# EAGLE schematic misko (EAGLE 8.1.0)
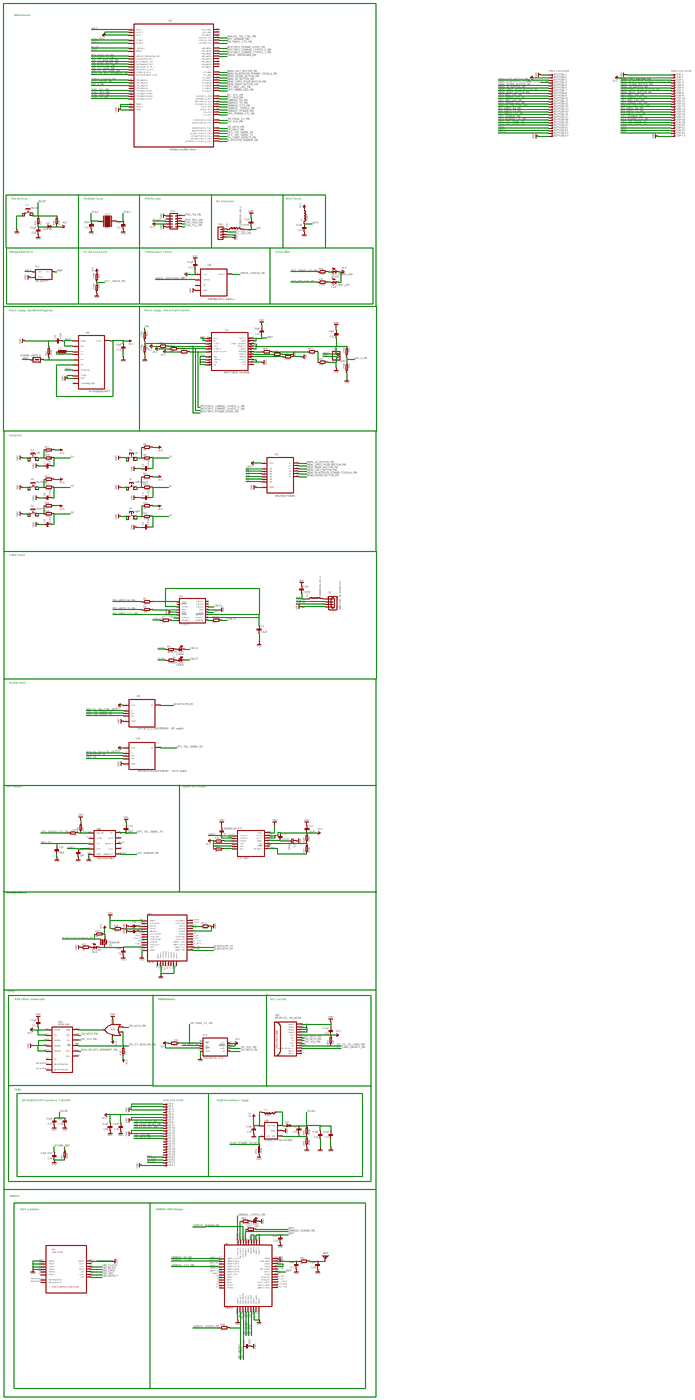
[diagram p0: schematic, sheet 1, overview]
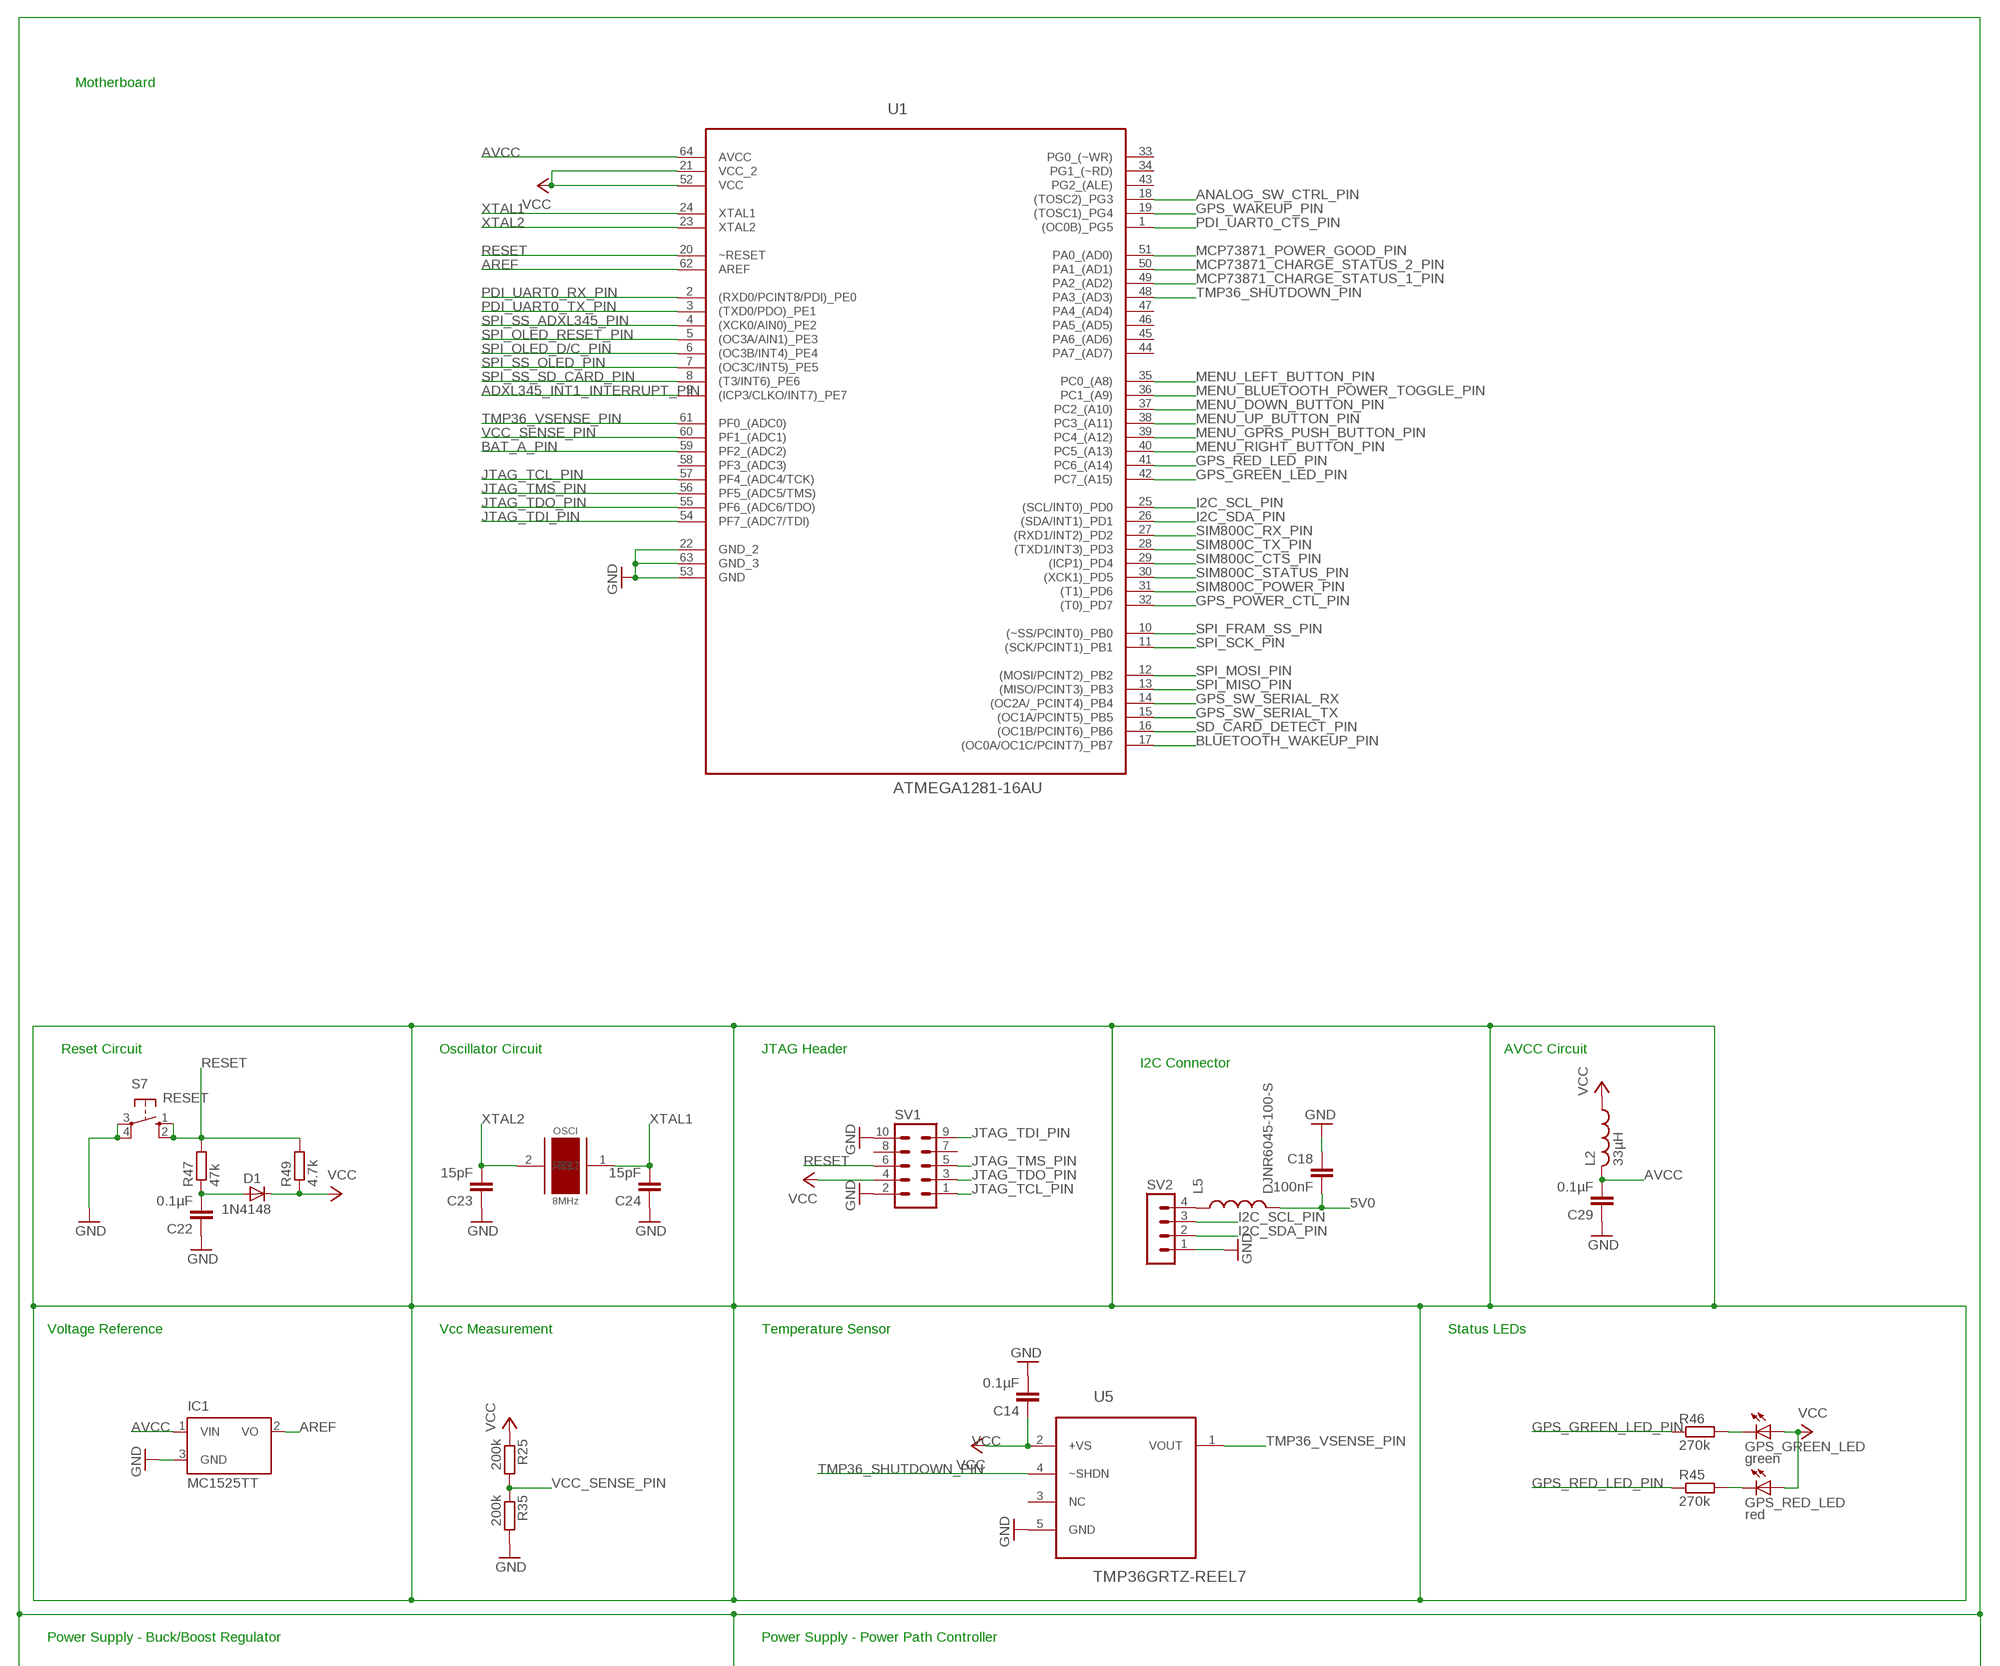
[diagram p1: schematic, sheet 1, part 1 of 5]
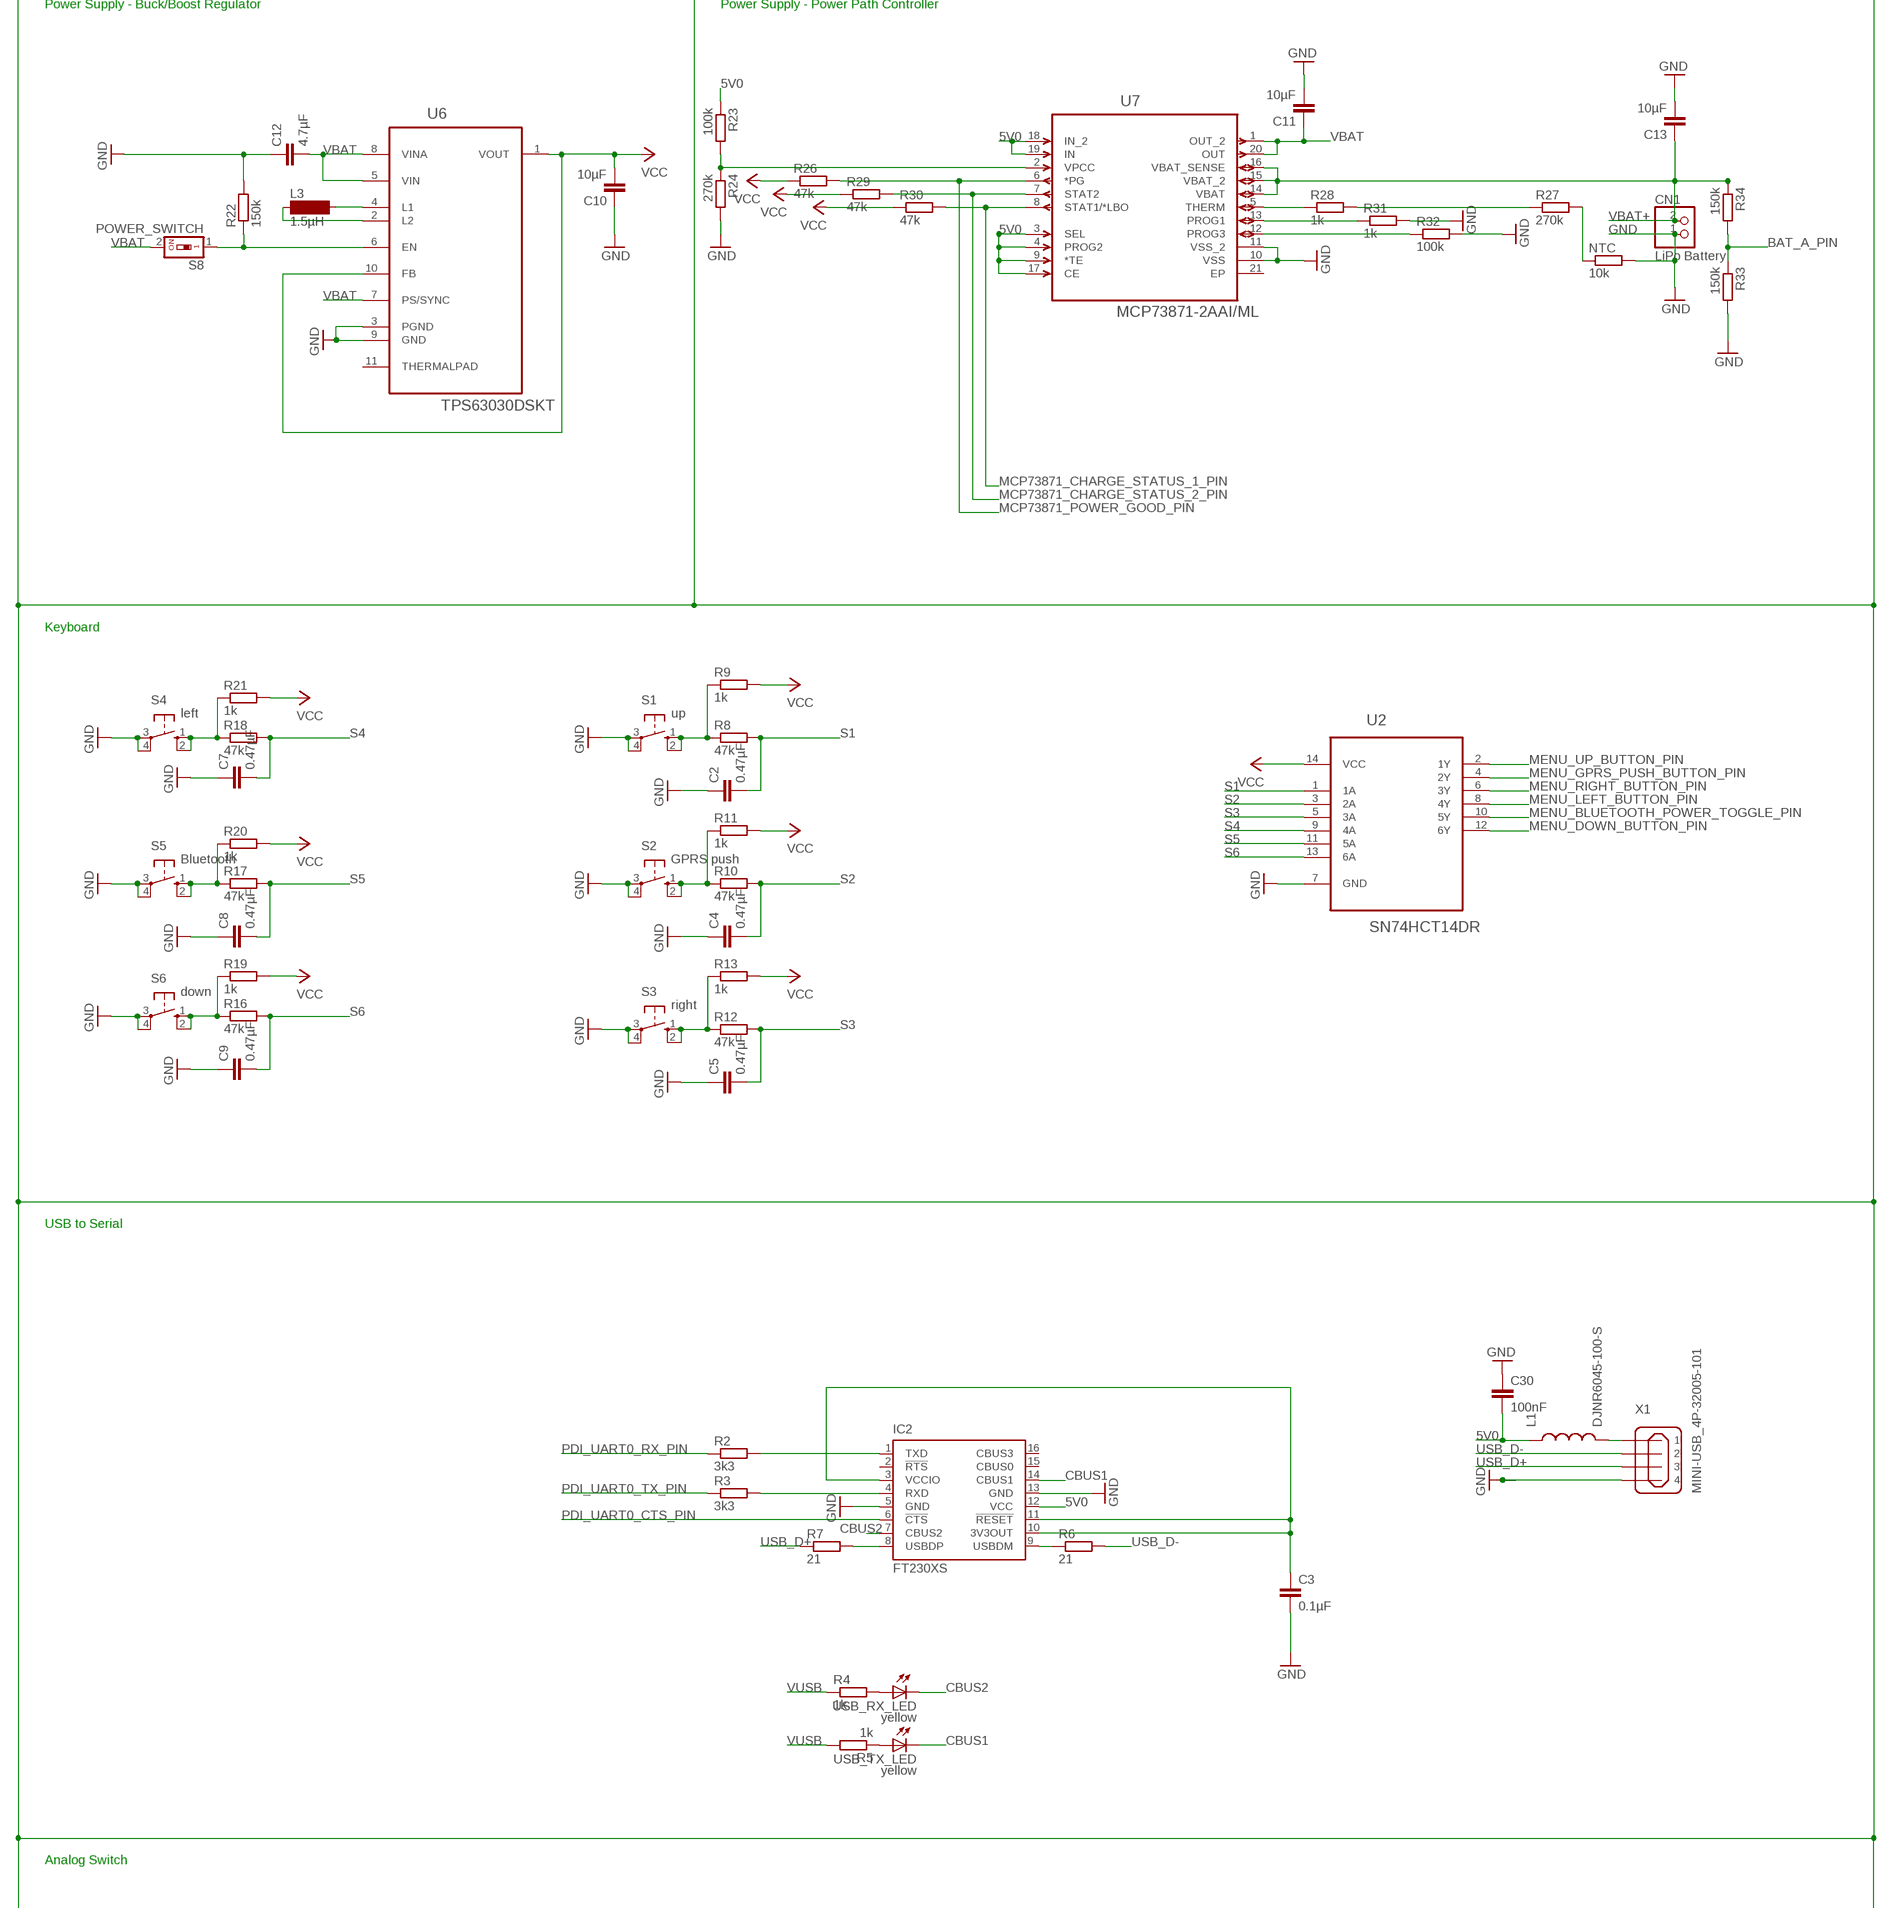
[diagram p2: schematic, sheet 1, part 2 of 5]
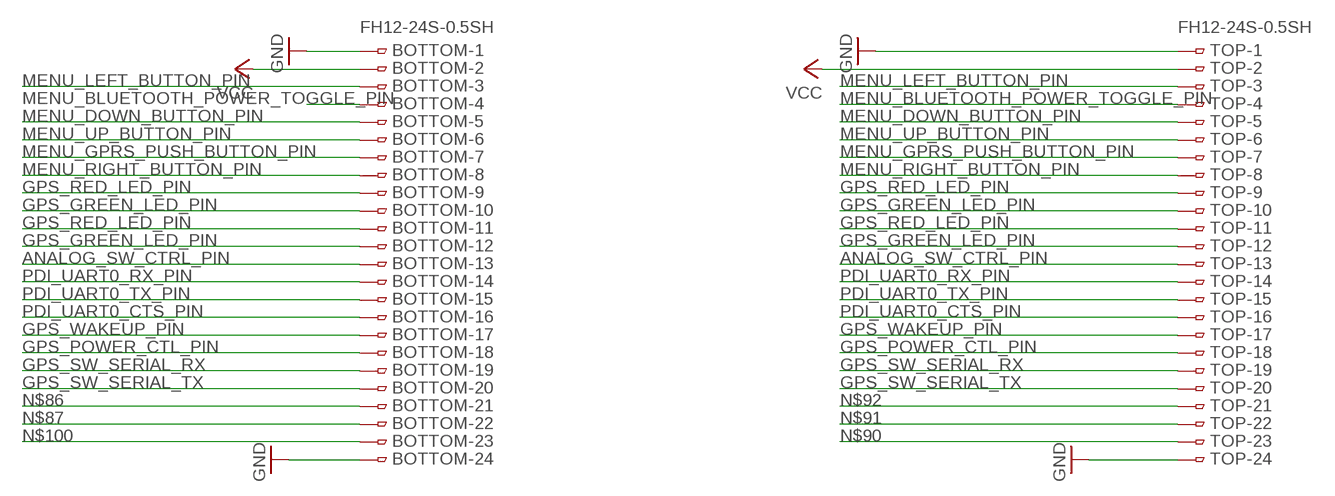
[diagram p3: schematic, sheet 1, part 3 of 5]
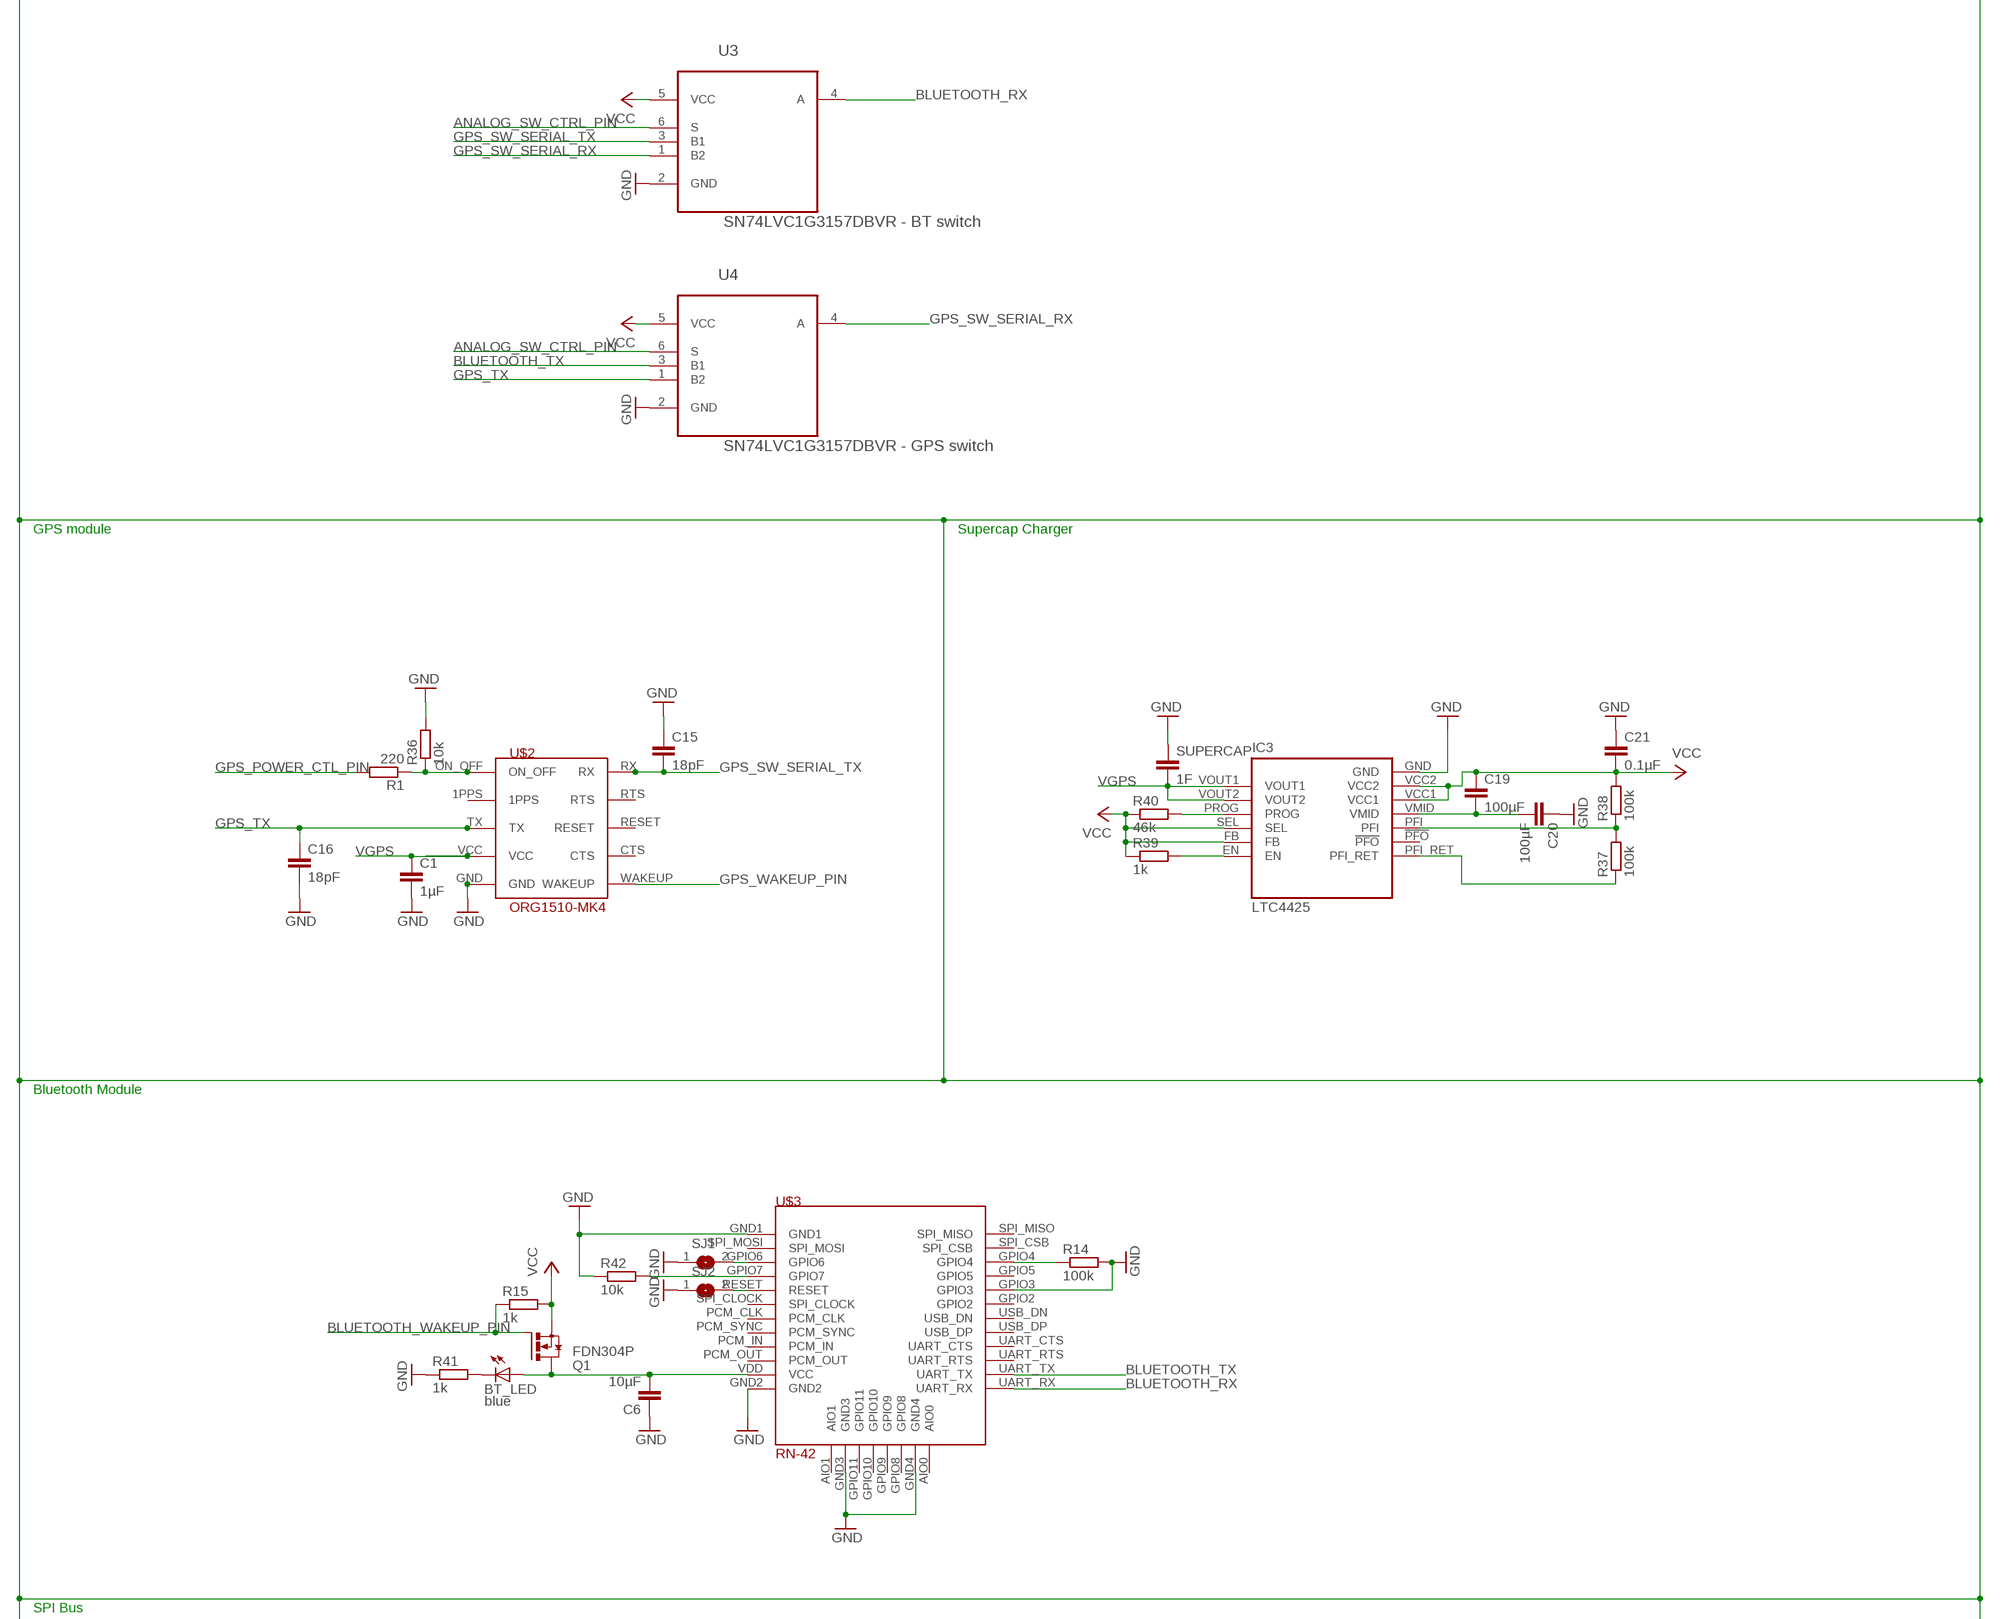
[diagram p4: schematic, sheet 1, part 4 of 5]
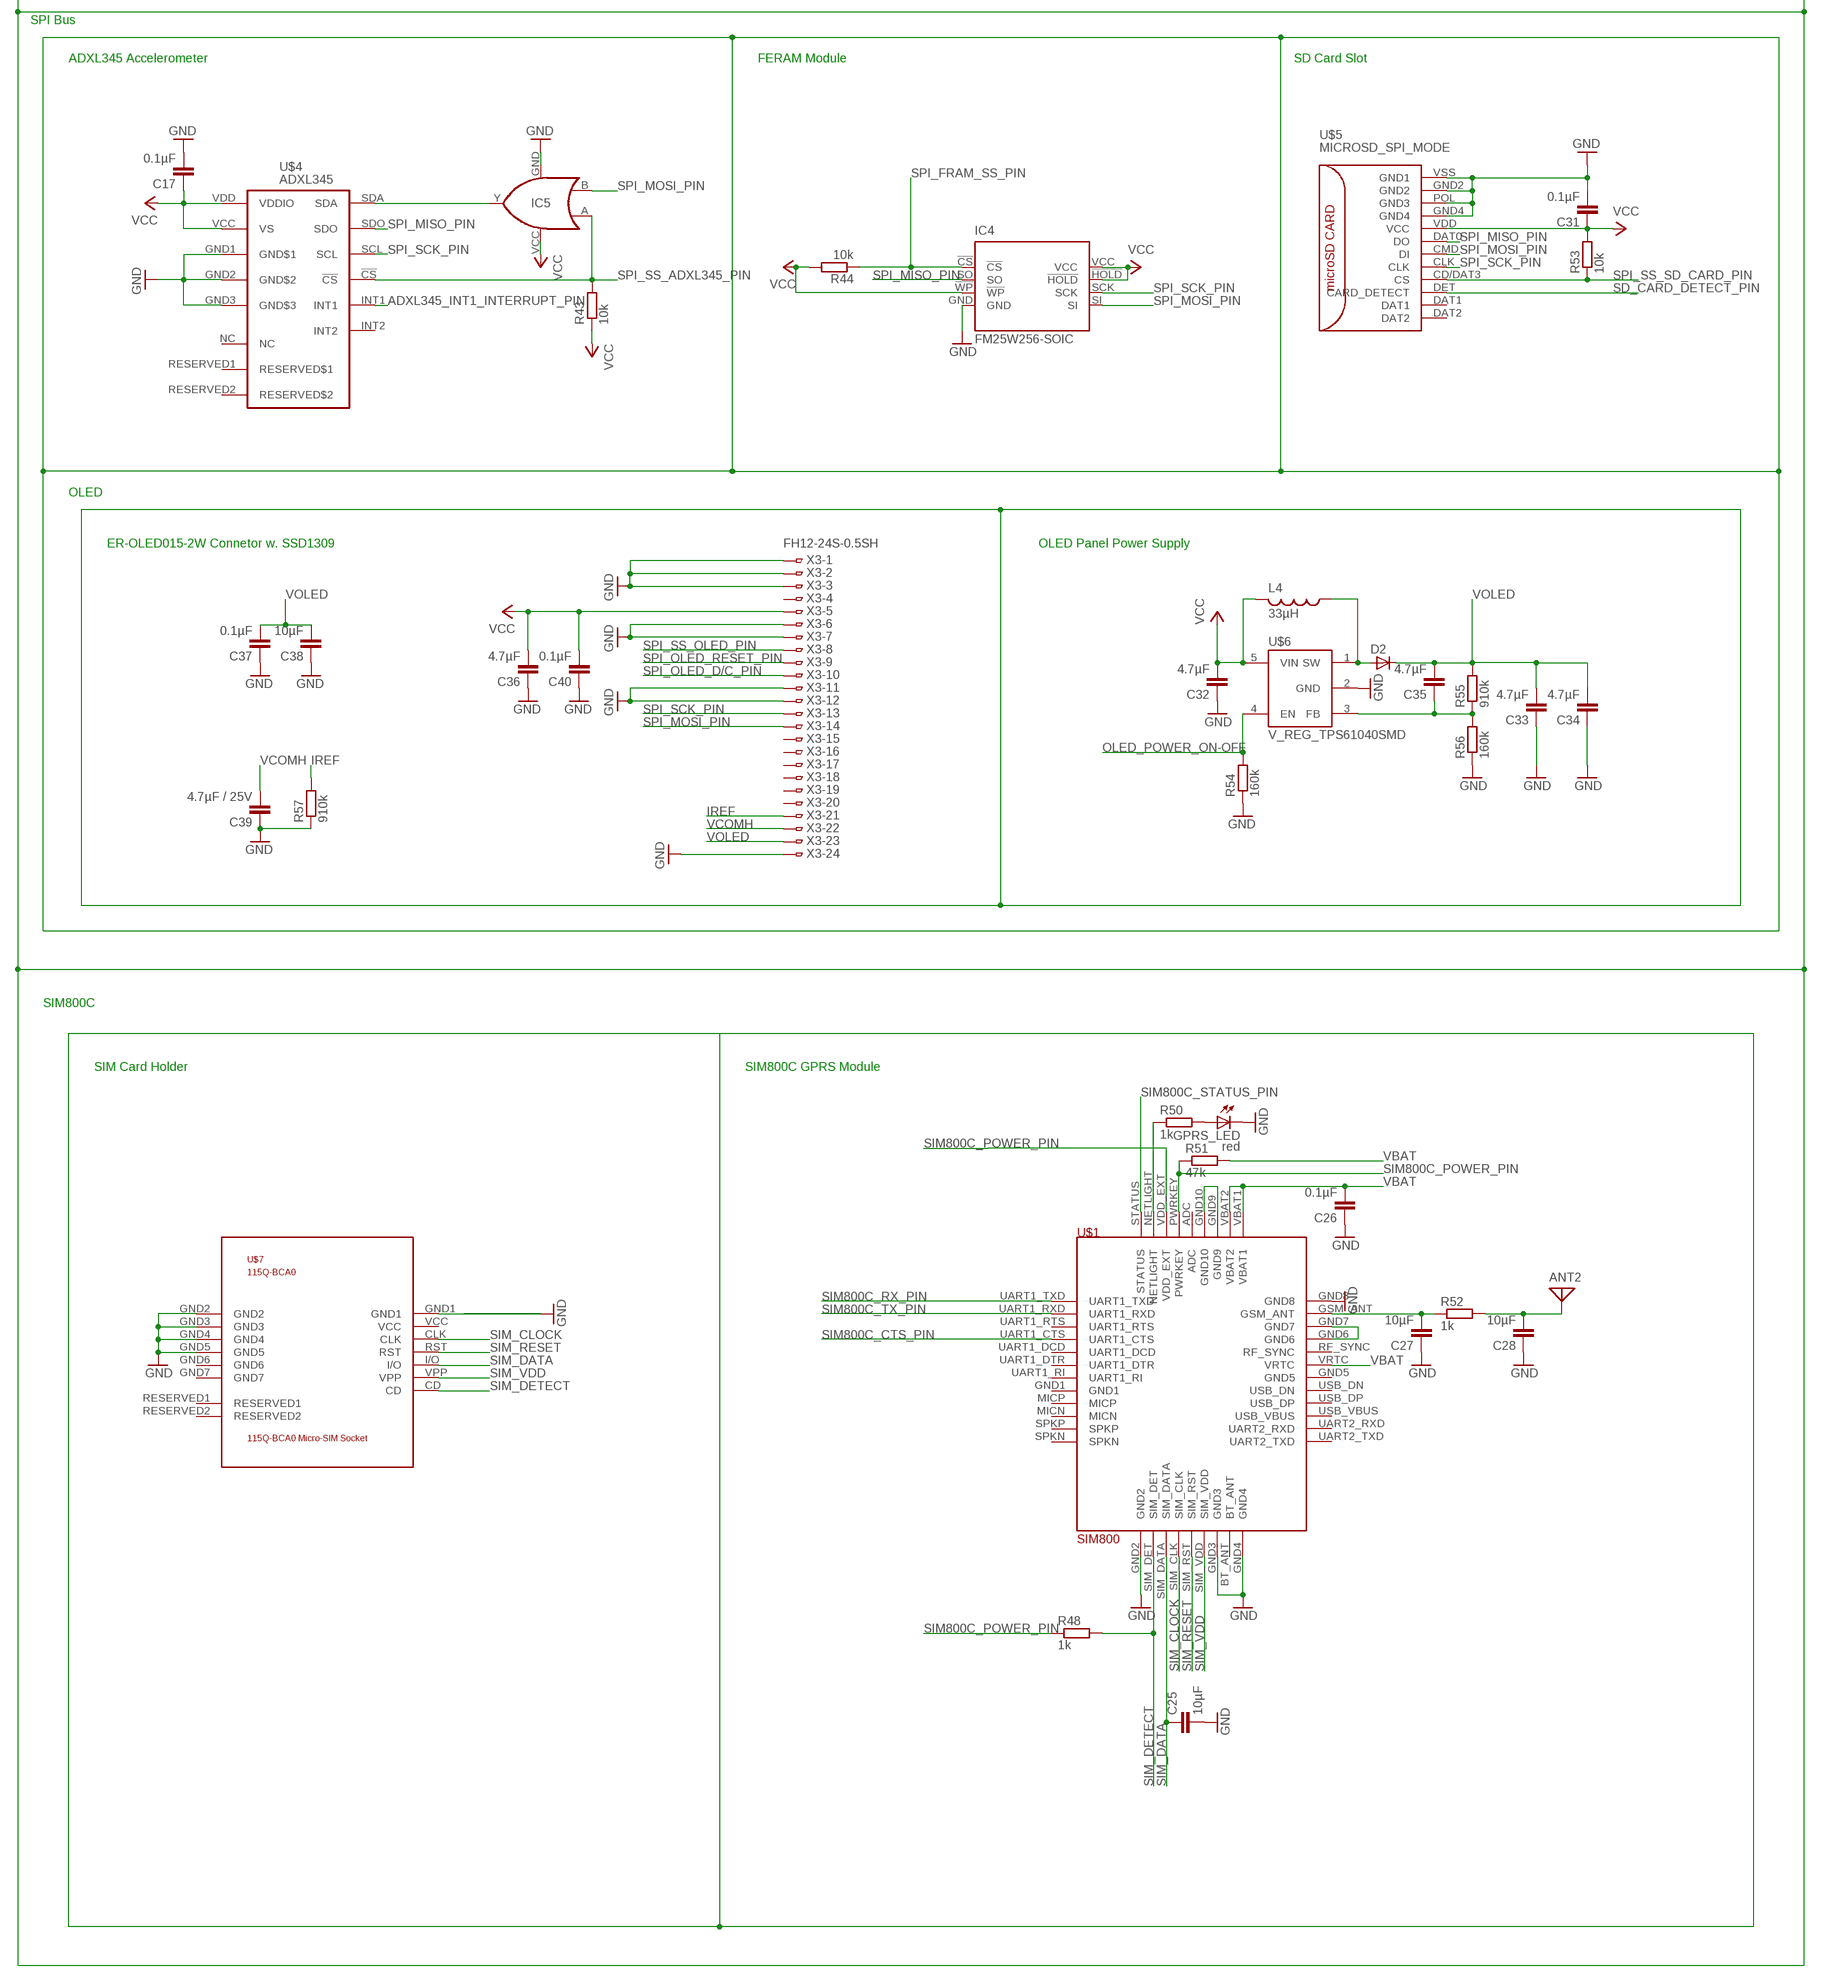
[diagram p5: schematic, sheet 1, part 5 of 5]

## Parts
ANT2  ANTENNASMD  [SMD]
BOTTOM  FH12-24S-0.5SH  [FH12-24S-0.5SH]
BT_LED  blue  LEDSML1206  [SML1206]
C1  1µF  C-EUC1206  [C1206]
C2  0.47µF  C-EUC0805  [C0805]
C3  0.1µF  C-EUC1206  [C1206]
C4  0.47µF  C-EUC0805  [C0805]
C5  0.47µF  C-EUC0805  [C0805]
C6  10µF  C-EUC0805  [C0805]
C7  0.47µF  C-EUC0805  [C0805]
C8  0.47µF  C-EUC0805  [C0805]
C9  0.47µF  C-EUC0805  [C0805]
C10  10µF  C-EUC0805  [C0805]
C11  10µF  C-EUC0805  [C0805]
C12  4.7µF  C-EUC0805  [C0805]
C13  10µF  C-EUC0805  [C0805]
C14  0.1µF  C-EUC0805  [C0805]
C15  18pF  C-EUC1206  [C1206]
C16  18pF  C-EUC0805  [C0805]
C17  0.1µF  C-EUC0805  [C0805]
C18  100nF  C-EUC1206  [C1206]
C19  100µF  C-EUC0805  [C0805]
C20  100µF  C-EUC0805  [C0805]
C21  0.1µF  C-EUC0805  [C0805]
C22  0.1µF  C-EUC0805  [C0805]
C23  15pF  C-EUC0805  [C0805]
C24  15pF  C-EUC0805  [C0805]
C25  10µF  C-EUC0805  [C0805]
C26  0.1µF  C-EUC0805  [C0805]
C27  10µF  C-EUC0805  [C0805]
C28  10µF  C-EUC0805  [C0805]
C29  0.1µF  C-EUC0805  [C0805]
C30  100nF  C-EUC1206  [C1206]
C31  0.1µF  C-EUC0805  [C0805]
C32  4.7µF  C-EUC0805  [C0805]
C33  4.7µF  C-EUC0805  [C0805]
C34  4.7µF  C-EUC0805  [C0805]
C35  4.7µF  C-EUC0805  [C0805]
C36  4.7µF  C-EUC0805  [C0805]
C37  0.1µF  C-EUC0805  [C0805]
C38  10µF  C-EUC0805  [C0805]
C39  4.7µF / 25V  C-EUC0805  [C0805]
C40  0.1µF  C-EUC0805  [C0805]
CN1  LiPo Battery  JST_2PIN-SMT  [JST-PH-2-SMT]
D1  1N4148  [D0805]
D2  D-SOD-80  [SOD80]
GPRS_LED  red  LEDSML1206  [SML1206]
GPS_GREEN_LED  green  LEDSML1206  [SML1206]
GPS_RED_LED  red  LEDSML1206  [SML1206]
IC1  MC1525TT  [SOT23]
IC2  FT230XS  [SSOP16]
IC3  LTC4425  [DFN12]
IC4  FM25W256-SOIC  [SOIC08]
IC5  74HCT1G32GW-DC  [SOT353/5]
L1  DJNR6045-100-S  [DJNR6045-100-S]
L2  33µH  L-US  [L0805]
L3  1.5µH  MS50  [MS50]
L4  33µH  L-US  [L0805]
L5  DJNR6045-100-S  [DJNR6045-100-S]
NTC  10k  R-EU_0204/5  [0204/5]
OSCI  8MHz  OSCILATOR  [QS]
Q1  FDN304P  N-HEXFET-2D_SOT232-IRLL014N  [SOT223]
R1  220  R-EU_R1206  [R1206]
R2  3k3  R-EU_R0805  [R0805]
R3  3k3  R-EU_R0805  [R0805]
R4  1k  R-EU_R1206  [R1206]
R5  1k  R-EU_R1206  [R1206]
R6  21  R-EU_R1206  [R1206]
R7  21  R-EU_R1206  [R1206]
R8  47k  R-EU_R0805  [R0805]
R9  1k  R-EU_R0805  [R0805]
R10  47k  R-EU_R0805  [R0805]
R11  1k  R-EU_R0805  [R0805]
R12  47k  R-EU_R0805  [R0805]
R13  1k  R-EU_R0805  [R0805]
R14  100k  R-EU_R1206  [R1206]
R15  1k  R-EU_R1206  [R1206]
R16  47k  R-EU_R0805  [R0805]
R17  47k  R-EU_R0805  [R0805]
R18  47k  R-EU_R0805  [R0805]
R19  1k  R-EU_R0805  [R0805]
R20  1k  R-EU_R0805  [R0805]
R21  1k  R-EU_R0805  [R0805]
R22  150k  R-EU_R0805  [R0805]
R23  100k  R-EU_R0805  [R0805]
R24  270k  R-EU_R0805  [R0805]
R25  200k  R-EU_R0805  [R0805]
R26  47k  R-EU_R0805  [R0805]
R27  270k  R-EU_R0805  [R0805]
R28  1k  R-EU_R0805  [R0805]
R29  47k  R-EU_R0805  [R0805]
R30  47k  R-EU_R0805  [R0805]
R31  1k  R-EU_R0805  [R0805]
R32  100k  R-EU_R0805  [R0805]
R33  150k  R-EU_R0805  [R0805]
R34  150k  R-EU_R0805  [R0805]
R35  200k  R-EU_R0805  [R0805]
R36  10k  R-EU_R1206  [R1206]
R37  100k  R-EU_R1206  [R1206]
R38  100k  R-EU_R1206  [R1206]
R39  1k  R-EU_R1206  [R1206]
R40  46k  R-EU_R1206  [R1206]
R41  1k  R-EU_R1206  [R1206]
R42  10k  R-EU_R1206  [R1206]
R43  10k  R-EU_R1206  [R1206]
R44  10k  R-EU_R1206  [R1206]
R45  270k  R-EU_R0805  [R0805]
R46  270k  R-EU_R0805  [R0805]
R47  47k  R-EU_R0805  [R0805]
R48  1k  R-EU_R1206  [R1206]
R49  4.7k  R-EU_R0805  [R0805]
R50  1k  R-EU_R1206  [R1206]
R51  47k  R-EU_R1206  [R1206]
R52  1k  R-EU_R1206  [R1206]
R53  10k  R-EU_R1206  [R1206]
R54  160k  R-EU_R1206  [R1206]
R55  910k  R-EU_R1206  [R1206]
R56  160k  R-EU_R1206  [R1206]
R57  910k  R-EU_R1206  [R1206]
S1  up  10-XX  [B3F-10XX]
S2  GPRS push  10-XX  [B3F-10XX]
S3  right  10-XX  [B3F-10XX]
S4  left  10-XX  [B3F-10XX]
S5  Bluetooth  10-XX  [B3F-10XX]
S6  down  10-XX  [B3F-10XX]
S7  RESET  10-XX  [B3F-10XX]
S8  POWER_SWITCH  SWS001  [SMS-001]
SJ1  SJW  [SJW]
SJ2  SJW  [SJW]
SUPERCAP  1F  C5/2.5  [C5B2.5]
SV1  MA05-2  [MA05-2]
SV2  MA04-1  [MA04-1]
TOP  FH12-24S-0.5SH  [FH12-24S-0.5SH]
U1  ATMEGA1281-16AU  [QFP80P1600X1600X120-64N]
U2  SN74HCT14DR  [SOIC127P600X175-14N]
U3  SN74LVC1G3157DBVR - BT switch  SN74LVC1G3157DBVR  [SOT95P280X145-6N]
U4  SN74LVC1G3157DBVR - GPS switch  SN74LVC1G3157DBVR  [SOT95P280X145-6N]
U5  TMP36GRTZ-REEL7  [SOT95P280X145-5N]
U6  TPS63030DSKT  [SON50P260X260X80-11N]
U7  MCP73871-2AAI/ML  [QFN50P400X400X100-21N]
U$1  SIM800  [SIM800C]
U$2  ORG1510-MK4  [PACKAGE]
U$3  RN-42  [RN-42]
U$4  ADXL345  [LGA14]
U$5  MICROSD_SPI_MODE  [MICRO_SD_CONNECTOR]
U$6  V_REG_TPS61040SMD  [SOT23-5]
U$7  115Q-BCA0  [115Q-BCA0]
USB_RX_LED  yellow  LEDSML1206  [SML1206]
USB_TX_LED  yellow  LEDSML1206  [SML1206]
X1  MINI-USB_4P-32005-101  [32005-101]
X3  FH12-24S-0.5SH  [FH12-24S-0.5SH]

## Nets
5V0: C18.2 C30.2 IC2.12(VCC) L1.P$1 L5.P$2 R23.1 U7.18(IN_2) U7.19(IN)
ADXL345_INT1_INTERRUPT_PIN: U1.9((ICP3/CLKO/INT7)_PE7) U$4.INT1
ANALOG_SW_CTRL_PIN: BOTTOM.13 TOP.13 U1.18((TOSC2)_PG3) U3.6(S) U4.6(S)
ANTENNA: ANT2.SIGNAL C28.2 R52.2
AREF: IC1.2(VO) U1.62(AREF)
AVCC: C29.2 IC1.1(VIN) L2.2 U1.64(AVCC)
BAT_A_PIN: R33.1 R34.2 U1.59(PF2_(ADC2))
BLUETOOTH_RX: U3.4(A) U$3.UART_RX
BLUETOOTH_TX: U4.3(B1) U$3.UART_TX
BLUETOOTH_WAKEUP_PIN: Q1.1(G) R15.1 U1.17((OC0A/OC1C/PCINT7)_PB7)
CBUS1: IC2.14(CBUS1) USB_TX_LED.C
CBUS2: IC2.7(CBUS2) USB_RX_LED.C
GND: BOTTOM.1 BOTTOM.24 C1.2 C2.1 C3.2 C4.1 C5.1 C6.1 C7.1 C8.1 C9.1 C10.1 C11.2 C12.1 C13.2 C14.2 C15.1 C16.2 C17.2 C18.1 C20.1 C21.1 C22.1 C23.1 C24.1 C25.2 C26.1 C27.1 C28.1 C29.1 C30.1 C31.2 C32.1 C33.1 C34.1 C36.1 C37.1 C38.1 C39.1 C40.1 CN1.1 GPRS_LED.C IC1.3(GND) IC2.5(GND) IC2.13(GND) IC3.GND IC4.GND IC5.GND NTC.2 R14.2 R22.2 R24.2 R31.2 R32.2 R33.2 R35.2 R36.2 R41.1 R42.1 R54.1 R56.1 R57.1 S1.3(P) S1.4(P1) S2.3(P) S2.4(P1) S3.3(P) S3.4(P1) S4.3(P) S4.4(P1) S5.3(P) S5.4(P1) S6.3(P) S6.4(P1) S7.3(P) S7.4(P1) SJ1.1 SJ2.1 SUPERCAP.1 SV1.2 SV1.10 SV2.1 TOP.1 TOP.24 U1.22(GND_2) U1.53(GND) U1.63(GND_3) U2.7(GND) U3.2(GND) U4.2(GND) U5.5(GND) U6.3(PGND) U6.9(GND) U7.10(VSS) U7.11(VSS_2) U$1.GND2 U$1.GND3 U$1.GND4 U$1.GND8 U$2.GND U$3.GND1 U$3.GND2 U$3.GND3 U$3.GND4 U$3.GPIO3 U$4.GND1(GND$1) U$4.GND2(GND$2) U$4.GND3(GND$3) U$5.GND2 U$5.GND4 U$5.POL(GND3) U$5.VSS(GND1) U$6.2(GND) U$7.GND1 U$7.GND2 U$7.GND3 U$7.GND4 U$7.GND5 X1.4 X3.1 X3.2 X3.3 X3.6 X3.7 X3.11 X3.12 X3.24
GPS_GREEN_LED_PIN: BOTTOM.10 BOTTOM.12 R46.1 TOP.10 TOP.12 U1.42(PC7_(A15))
GPS_POWER_CTL_PIN: BOTTOM.18 R1.1 R36.1 TOP.18 U1.32((T0)_PD7) U$2.ON_OFF
GPS_RED_LED_PIN: BOTTOM.9 BOTTOM.11 R45.1 TOP.9 TOP.11 U1.41(PC6_(A14))
GPS_SW_SERIAL_RX: BOTTOM.19 TOP.19 U1.14((OC2A/_PCINT4)_PB4) U3.1(B2) U4.4(A)
GPS_SW_SERIAL_TX: BOTTOM.20 C15.2 TOP.20 U1.15((OC1A/PCINT5)_PB5) U3.3(B1) U$2.RX
GPS_TX: C16.1 U4.1(B2) U$2.TX
GPS_WAKEUP_PIN: BOTTOM.17 TOP.17 U1.19((TOSC1)_PG4) U$2.WAKEUP
I2C_SCL_PIN: SV2.3 U1.25((SCL/INT0)_PD0)
I2C_SDA_PIN: SV2.2 U1.26((SDA/INT1)_PD1)
IREF: R57.2 X3.21
JTAG_TCL_PIN: SV1.1 U1.57(PF4_(ADC4/TCK))
JTAG_TDI_PIN: SV1.9 U1.54(PF7_(ADC7/TDI))
JTAG_TDO_PIN: SV1.3 U1.55(PF6_(ADC6/TDO))
JTAG_TMS_PIN: SV1.5 U1.56(PF5_(ADC5/TMS))
MCP73871_CHARGE_STATUS_1_PIN: R30.2 U1.49(PA2_(AD2)) U7.8(STAT1/*LBO)
MCP73871_CHARGE_STATUS_2_PIN: R29.2 U1.50(PA1_(AD1)) U7.7(STAT2)
MCP73871_POWER_GOOD_PIN: R26.2 U1.51(PA0_(AD0)) U7.6(*PG)
MENU_BLUETOOTH_POWER_TOGGLE_PIN: BOTTOM.4 TOP.4 U1.36(PC1_(A9)) U2.10(5Y)
MENU_DOWN_BUTTON_PIN: BOTTOM.5 TOP.5 U1.37(PC2_(A10)) U2.12(6Y)
MENU_GPRS_PUSH_BUTTON_PIN: BOTTOM.7 TOP.7 U1.39(PC4_(A12)) U2.4(2Y)
MENU_LEFT_BUTTON_PIN: BOTTOM.3 TOP.3 U1.35(PC0_(A8)) U2.8(4Y)
MENU_RIGHT_BUTTON_PIN: BOTTOM.8 TOP.8 U1.40(PC5_(A13)) U2.6(3Y)
MENU_UP_BUTTON_PIN: BOTTOM.6 TOP.6 U1.38(PC3_(A11)) U2.2(1Y)
N$1: R22.1 S8.1 U6.6(EN)
N$3: IC2.1(TXD) R2.2
N$5: L5.P$1 SV2.4
N$6: R4.2 USB_RX_LED.A
N$7: IC2.8(USBDP) R7.2
N$8: R5.1 USB_TX_LED.A
N$9: IC2.9(USBDM) R6.1
N$10: C3.1 IC2.3(VCCIO) IC2.10(3V3OUT) IC2.11(!RESET)
N$11: R23.2 R24.1 U7.2(VPCC)
N$12: IC2.4(RXD) R3.2
N$13: R1.2
N$14: R8.1 R9.1 S1.1(S) S1.2(S1)
N$15: U7.3(SEL) U7.4(PROG2) U7.9(*TE) U7.17(CE)
N$16: R12.1 R13.1 S3.1(S) S3.2(S1)
N$18: R28.1 U7.5(THERM)
N$19: R27.1 R28.2
N$20: NTC.1 R27.2
N$21: R10.1 R11.1 S2.1(S) S2.2(S1)
N$22: R31.1 U7.13(PROG1)
N$23: R32.1 U7.12(PROG3)
N$24: IC3.PFI R37.2 R38.1
N$25: IC3.PROG R40.2
N$26: IC3.EN R39.2
N$27: IC3.PFI_RET R37.1
N$28: R17.1 R20.1 S5.1(S) S5.2(S1)
N$29: R16.1 R19.1 S6.1(S) S6.2(S1)
N$30: R18.1 R21.1 S4.1(S) S4.2(S1)
N$31: C22.2 D1.A R47.1
N$32: C19.2 C20.2 IC3.VMID
N$33: R42.2 U$3.GPIO7
N$34: BT_LED.A C6.2 Q1.2(D) Q1.4(D) U$3.VDD(VCC)
N$35: BT_LED.C R41.2
N$36: R14.1 U$3.GPIO4
N$38: SJ1.2 U$3.GPIO6
N$39: SJ2.2 U$3.RESET
N$40: IC5.Y U$4.SDA
N$41: GPS_GREEN_LED.C R46.2
N$43: GPS_RED_LED.C R45.2
N$44: GPRS_LED.A R50.2
N$45: R50.1 U$1.NETLIGHT
N$46: C27.2 R52.1 U$1.GSM_ANT
N$47: U$1.GND9 U$1.GND10
N$48: U$1.GND6 U$1.GND7
N$53: L3.2 U6.4(L1)
N$54: L3.1 U6.2(L2)
N$73: D2.2(A) L4.1 U$6.1(SW)
N$76: C35.1 R55.1 R56.2 U$6.3(FB)
N$86: BOTTOM.21
N$87: BOTTOM.22
N$90: TOP.23
N$91: TOP.22
N$92: TOP.21
N$100: BOTTOM.23
OLED_POWER_ON-OFF: R54.2 U$6.4(EN)
PDI_UART0_CTS_PIN: BOTTOM.16 IC2.6(!CTS) TOP.16 U1.1((OC0B)_PG5)
PDI_UART0_RX_PIN: BOTTOM.14 R2.1 TOP.14 U1.2((RXD0/PCINT8/PDI)_PE0)
PDI_UART0_TX_PIN: BOTTOM.15 R3.1 TOP.15 U1.3((TXD0/PDO)_PE1)
RESET: R47.2 R49.2 S7.1(S) S7.2(S1) SV1.6 U1.20(~RESET)
S1: C2.2 R8.2 U2.1(1A)
S2: C4.2 R10.2 U2.3(2A)
S3: C5.2 R12.2 U2.5(3A)
S4: C7.2 R18.2 U2.9(4A)
S5: C8.2 R17.2 U2.11(5A)
S6: C9.2 R16.2 U2.13(6A)
SD_CARD_DETECT_PIN: U1.16((OC1B/PCINT6)_PB6) U$5.DET(CARD_DETECT)
SIM800C_CTS_PIN: U1.29((ICP1)_PD4) U$1.UART1_CTS
SIM800C_POWER_PIN: R48.1 R51.1 U1.31((T1)_PD6) U$1.PWRKEY U$1.VDD_EXT
SIM800C_RX_PIN: U1.27((RXD1/INT2)_PD2) U$1.UART1_TXD
SIM800C_STATUS_PIN: U1.30((XCK1)_PD5) U$1.STATUS
SIM800C_TX_PIN: U1.28((TXD1/INT3)_PD3) U$1.UART1_RXD
SIM_CLOCK: U$1.SIM_CLK U$7.CLK
SIM_DATA: C25.1 U$1.SIM_DATA U$7.I/O
SIM_DETECT: R48.2 U$1.SIM_DET U$7.CD
SIM_RESET: U$1.SIM_RST U$7.RST
SIM_VDD: U$1.SIM_VDD U$7.VPP
SPI_FRAM_SS_PIN: IC4.!CS! R44.1 U1.10((~SS/PCINT0)_PB0)
SPI_MISO_PIN: IC4.SO U1.13((MISO/PCINT3)_PB3) U$4.SDO U$5.DAT0(DO)
SPI_MOSI_PIN: IC4.SI IC5.B U1.12((MOSI/PCINT2)_PB2) U$5.CMD(DI) X3.14
SPI_OLED_D/C_PIN: U1.6((OC3B/INT4)_PE4) X3.10
SPI_OLED_RESET_PIN: U1.5((OC3A/AIN1)_PE3) X3.9
SPI_SCK_PIN: IC4.SCK U1.11((SCK/PCINT1)_PB1) U$4.SCL U$5.CLK X3.13
SPI_SS_ADXL345_PIN: IC5.A R43.2 U1.4((XCK0/AIN0)_PE2) U$4.!CS!
SPI_SS_OLED_PIN: U1.7((OC3C/INT5)_PE5) X3.8
SPI_SS_SD_CARD_PIN: R53.1 U1.8((T3/INT6)_PE6) U$5.CD/DAT3(CS)
TMP36_SHUTDOWN_PIN: U1.48(PA3_(AD3)) U5.4(~SHDN)
TMP36_VSENSE_PIN: U1.61(PF0_(ADC0)) U5.1(VOUT)
USB_D+: R7.1 X1.3
USB_D-: R6.2 X1.2
VBAT: C11.1 C12.2 C26.2 R51.2 S8.2 U6.5(VIN) U6.7(PS/SYNC) U6.8(VINA) U7.1(OUT_2) U7.20(OUT) U$1.VBAT1 U$1.VBAT2 U$1.VRTC
VBAT+: C13.1 CN1.2 R34.1 U7.14(VBAT) U7.15(VBAT_2) U7.16(VBAT_SENSE)
VCC: BOTTOM.2 C10.2 C14.1 C17.1 C19.1 C21.2 C31.1 C32.2 C36.2 C40.2 D1.C GPS_GREEN_LED.A GPS_RED_LED.A IC3.FB IC3.SEL IC3.VCC1 IC3.VCC2 IC4.!HOLD! IC4.!WP! IC4.VCC IC5.VCC L2.1 L4.2 Q1.3(S) R9.2 R11.2 R13.2 R15.2 R19.2 R20.2 R21.2 R25.1 R26.1 R29.1 R30.1 R38.2 R39.1 R40.1 R43.1 R44.2 R49.1 R53.2 SV1.4 TOP.2 U1.21(VCC_2) U1.52(VCC) U2.14(VCC) U3.5(VCC) U4.5(VCC) U5.2(+VS) U6.1(VOUT) U6.10(FB) U$4.VCC(VS) U$4.VDD(VDDIO) U$5.VDD(VCC) U$6.5(VIN) X3.5
VCC_SENSE_PIN: R25.2 R35.1 U1.60(PF1_(ADC1))
VCOMH: C39.2 X3.22
VGPS: C1.1 IC3.VOUT1 IC3.VOUT2 SUPERCAP.2 U$2.VCC
VOLED: C33.2 C34.2 C35.2 C37.2 C38.2 D2.1(C) R55.2 X3.23
VUSB: L1.P$2 R4.1 R5.2 X1.1
XTAL1: C24.2 OSCI.1 U1.24(XTAL1)
XTAL2: C23.2 OSCI.2 U1.23(XTAL2)
Unconnected: IC2.2(!RTS) IC2.15(CBUS0) IC2.16(CBUS3) SV1.7 SV1.8 U1.33(PG0_(~WR)) U1.34(PG1_(~RD)) U1.43(PG2_(ALE)) U1.44(PA7_(AD7)) U1.45(PA6_(AD6)) U1.46(PA5_(AD5)) U1.47(PA4_(AD4)) U1.58(PF3_(ADC3)) U5.3(NC) U6.11(THERMALPAD) U7.21(EP) U$1.ADC U$1.BT_ANT U$1.GND1 U$1.GND5 U$1.MICN U$1.MICP U$1.RF_SYNC U$1.SPKN U$1.SPKP U$1.UART1_DCD U$1.UART1_DTR U$1.UART1_RI U$1.UART1_RTS U$1.UART2_RXD U$1.UART2_TXD U$1.USB_DN U$1.USB_DP U$2.1PPS U$2.CTS U$2.RESET U$2.RTS U$3.AIO0 U$3.AIO1 U$3.GPIO2 U$3.GPIO5 U$3.GPIO8 U$3.GPIO9 U$3.GPIO10 U$3.GPIO11 U$3.PCM_CLK U$3.PCM_IN U$3.PCM_OUT U$3.PCM_SYNC U$3.SPI_CLOCK U$3.SPI_CSB U$3.SPI_MISO U$3.SPI_MOSI U$3.UART_CTS U$3.UART_RTS U$3.USB_DN U$3.USB_DP U$4.INT2 U$4.NC U$4.RESERVED1(RESERVED$1) U$4.RESERVED2(RESERVED$2) U$5.DAT1 U$5.DAT2 U$7.GND6 U$7.GND7 U$7.RESERVED1 U$7.RESERVED2 X3.4 X3.15 X3.16 X3.17 X3.18 X3.19 X3.20

## Notes on the sheet
- Motherboard
- Reset Circuit | Oscillator Circuit | JTAG Header | AVCC Circuit
- I2C Connector
- Voltage Reference | Vcc Measurement | Temperature Sensor | Status LEDs
- Power Supply - Buck/Boost Regulator | Power Supply - Power Path Controller
- Keyboard
- USB to Serial
- Analog Switch
- GPS module | Supercap Charger
- Bluetooth Module
- SPI Bus
- ADXL345 Accelerometer | FERAM Module | SD Card Slot
- OLED
- ER-OLED015-2W Connetor w. SSD1309 | OLED Panel Power Supply
- SIM800C
- SIM Card Holder | SIM800C GPRS Module

## Power pins joined to a net without a drawn wire
!PFO!: IC3.!PFO!
USB_VBUS: U$1.USB_VBUS
VCC: U$7.VCC

## Library data of the parts
ANT2 = discrete:ANTENNA: Antenna
BOTTOM TOP X3 = con-hirose:FH12-24S-0.5S: 0.5mm Pitch Connectors For FPC/FFC Source: Data sheet <http://www.hirose.co.jp/cataloge_hp/e58605370.pdf>; MPN: FH12-24S-0.5SH(55); OC_FARNELL: 1324552; OC_NEWARK: 34M6170
BT_LED GPRS_LED GPS_GREEN_LED GPS_RED_LED USB_RX_LED USB_TX_LED = led:LED: LED OSRAM: - CHIPLED LG R971, LG N971, LY N971, LG Q971, LY Q971, LO R971, LY R971 LH N974, LH R974 LS Q976, LO Q976, LY Q976 LO Q996 - Hyper CHIPLED LW Q18S LB Q993, LB Q99A, LB R99A - SideLED LS A670, LO A670, LY A670, LG A670, LP A670 LB A673, LV A673, LT A673, LW A673 LH A674 LY A675 LS A676, LA A676, LO A676, LY A676, LW A676 LS A679, LY A679, LG A679 - Hyper Micro SIDELED® LS Y876, LA Y876, LO Y876, LY Y876 LT Y87S - SmartLED LW L88C, LW L88S LB L89C, LB L89S, LG L890 LS L89K, LO L89K, LY L89K LS L896, LA L896, LO L896, LY L896 - TOPLED LS T670, LO T670, LY T670, LG T670, LP T670 LSG T670, LSP T670, LSY T670, LOP T670, LYG T670 LG T671, LOG T671, LSG T671 LB T673, LV T673, LT T673, LW T673 LH T674 LS T676, LA T676, LO T676, LY T676, LB T676, LH T676, LSB T676, LW T676 LB T67C, LV T67C, LT T67C, LS T67K, LO T67K, LY T67K, LW E67C LS E67B, LA E67B, LO E67B, LY E67B, LB E67C, LV E67C, LT E67C LW T67C LS T679, LY T679, LG T679 LS T770, LO T770, LY T770, LG T770, LP T770 LB T773, LV T773, LT T773, LW T773 LH T774 LS E675, LA E675, LY E675, LS T675 LS T776, LA T776, LO T776, LY T776, LB T776 LHGB T686 LT T68C, LB T68C - Hyper Mini TOPLED® LB M676 - Mini TOPLED Santana® LG M470 LS M47K, LO M47K, LY M47K Source: http://www.osram.convergy.de LUXEON: - LUMILED® LXK2-PW12-R00, LXK2-PW12-S00, LXK2-PW14-U00, LXK2-PW14-V00 LXK2-PM12-R00, LXK2-PM12-S00, LXK2-PM14-U00 LXK2-PE12-Q00, LXK2-PE12-R00, LXK2-PE12-S00, LXK2-PE14-T00, LXK2-PE14-U00 LXK2-PB12-K00, LXK2-PB12-L00, LXK2-PB12-M00, LXK2-PB14-N00, LXK2-PB14-P00, LXK2-PB14-Q00 LXK2-PR12-L00, LXK2-PR12-M00, LXK2-PR14-Q00, LXK2-PR14-R00 LXK2-PD12-Q00, LXK2-PD12-R00, LXK2-PD12-S00 LXK2-PH12-R00, LXK2-PH12-S00 LXK2-PL12-P00, LXK2-PL12-Q00, LXK2-PL12-R00 Source: www.luxeon.com KINGBRIGHT: KA-3528ASYC Source: www.kingbright.com
C1-C5 C7-C15 C18 C22-C24 C29 C30 = resistor:C-EU: CAPACITOR, European symbol
C6 C16 C17 C19-C21 C25-C28 C31-C40 = rcl:C-EU: CAPACITOR, European symbol
CN1 = SIM800C:JST_2PIN: JST 2-Pin Connectors of various flavors SMT-RA (S2B-PH-SM4) 4UConnector #17311 SMT (B2B-PH-SM4) THM-RA (S2B-PH) THM (B2B-PH)
D1 = Diode2:1N4148: DIODE high speed (Philips)
D2 = semicon-smd-ipc:D-: DIODE unfilled
IC1 = microchip:MC15*: 2.5V and 4.096V Voltage References Source: http://www.microchip.com .. 21653b.pdf; OC_FARNELL: unknown; OC_NEWARK: unknown
IC2 = ftdichip:FT230X: USB to BASIC UART IC Auto generated by make-symbol-device-package-bsdl.ulp Rev. 43 Source: Data sheet <http://www.ftdichip.com/Support/Documents/DataSheets/ICs/DS_FT230X.pdf>
IC3 = LTC4425 Supercap Charger:LTC4425: The ISL85003 and ISL85003A are synchronous buck regulators with integrated high-side and low-side FET’s. The regulator can operate from an input voltage range of 4.5V to 18V while delivering a very efficient continuous 3A current. This is all delivered in a very compact 3x4mm DFN package. More about it you can find at ISL85003 <http://www.intersil.com/en/products/power-management/switching-regulators/integrated-fet-regulators/ISL85003.html> The library has been designed by Richard Magdycz <https://www.facebook.com/groups/eaglecadsoftUK>
IC4 = FM25W256 FERAM:FM25W256: FeRAM Module; OC_FARNELL: unknown; OC_NEWARK: unknown
IC5 = 74HCT1G32GW:74HCT1G32GW: Two Input OR gate
L1 L5 = DJNR6045-100S Power Inductor:DJNR6045-100-S: Shielded Power Inductors Package 6.6 × 6.6 mm x 4.1 mm high Source: http://www.farnell.com/datasheets/1681958.pdf
L2 L4 = rcl:L-US: INDUCTOR, American symbol
L3 = inductor-neosid:MS50: INDUCTOR SMD power inductor; OC_FARNELL: unknown; OC_NEWARK: unknown
NTC R2 R3 R8-R13 R16-R35 R45-R47 R49 = rcl:R-EU_: RESISTOR, European symbol
OSCI = special:OSCILATOR
Q1 = transistor-power:N-HEXFET-2D_?-*: HEXFET® Power MOSFET 2 Drain connects http://www.irf.com/product-info/datasheets/data/irll014n.pdf
R1 R4-R7 R14 R15 R36-R44 R48 R50-R57 = resistor:R-EU_: RESISTOR, European symbol
S1-S7 = switch-omron:10-XX: OMRON SWITCH; MPN: B3F-1000; OC_FARNELL: 176432; OC_NEWARK: 36M3542
S8 = smd-special:SWS001: SMD Dip Switch 1 pol.
SJ1 SJ2 = jumper:SJ: SMD solder JUMPER
SUPERCAP = capacitor-wima:C: CAPACITOR naming: grid - package width
SV1 = con-lstb:MA05-2: PIN HEADER; OC_FARNELL: unknown; OC_NEWARK: unknown
SV2 = con-lstb:MA04-1: PIN HEADER; OC_FARNELL: unknown; OC_NEWARK: unknown
U1 = Atmel_By_element14_Batch_1-00:ATMEGA1281-16AU: Microcontroller; DESCRIPTION: Microcontroller; MPN: ATMEGA1281-16AU; OC_FARNELL: 1455092; OC_NEWARK: 58M3721; PACKAGE: QFP-64; SUPPLIER: ATMEL
U2 = Texas Instruments_By_element14_Batch_1:SN74HCT14DR: Hex Inverting Schmitt Trigger Inverters; MPN: SN74HCT14DR; OC_FARNELL: 1387913; OC_NEWARK: 67K2834; PACKAGE: SOIC-14; SUPPLIER: Texas Instruments
U3 U4 = Texas Instruments_By_element14_Batch_1:SN74LVC1G3157DBVR: SINGLE-POLE, DOUBLE-THROW ANALOG SWITCH; MPN: SN74LVC1G3157DBVR; OC_FARNELL: 1470910; OC_NEWARK: 32H6364; PACKAGE: SOT-23-6; SUPPLIER: Texas Instruments
U5 = TMP36GRTZ:TMP36GRTZ-REEL7: Low Voltage Temperature Sensors; MPN: TMP36GRTZ-REEL7; OC_FARNELL: 1661084; OC_NEWARK: 96K2116; PACKAGE: SOT23-5; SUPPLIER: Analog Devices
U6 = Texas Instruments_By_element14_Batch_1:TPS63030DSKT: HIGH EFFICIENCY SINGLE INDUCTOR BUCK-BOOST CONVERTER WITH 1-A SWITCHES; MPN: TPS63030DSKT; OC_FARNELL: 1686303; OC_NEWARK: 19P7478; PACKAGE: SON-10; SUPPLIER: Texas Instruments
U7 = Microchip-MCP73871-2AAI_ML:MCP73871-2AAI/ML: IC, BATTERY CHARGER, 1A; MPN: MCP73871-2AAI/ML; OC_FARNELL: 1642487; OC_NEWARK: 54M4955; PACKAGE: QFN-20; SUPPLIER: Microchip
U$1 = SIM800 GPRS Module:SIM800
U$2 = ORG1510-MK4 GPS module:ORG1510-MK4
U$3 = EN42-I Bluetooth Module:RN-42
U$4 = ADXL345 Accelerometer:ADXL345: 3-Axis, ±2 g/±4 g/±8 g/±16 g Digital Accelerometer
U$5 = Molex SD-47309 SD Card Slot:MICROSD_SPI_MODE: MOLEX - 49225-0821 - CONNECTEUR MICRO SD PUSH/PUSH REV Fabricant: MOLEX Code commande Farnell: 1366700 <http://fr.farnell.com/molex/49225-0821/connecteur-micro-sd-push-push-rev/dp/1366700?Ntt=1366700> Référence fabricant: 49225-0821
U$6 = SparkFun-PowerIC:V_REG_TPS61040
U$7 = 115Q-BCA0 Micro-SIM Socket:115Q-BCA0
X1 = con-cypressindustries:MINI-USB_4P-: MINI USB 4 Pol. Source: www.cypressindustries.com; OC_FARNELL: unknown; OC_NEWARK: unknown